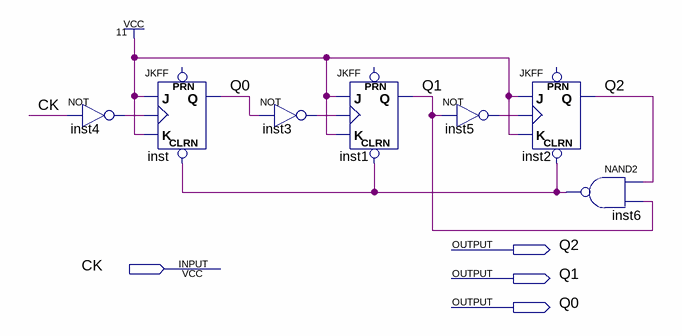
[diagram p0: schematic sheet]
// Quartus schematic 6_MOD_A_U.bdf as structural Verilog: 7 symbols, 4 pins
module \6_MOD_A_U  (
  input  CK,
  output Q2,
  output Q1,
  output Q0
);

  wire inst3_out, inst4_out, inst5_out, inst6_out;

  not inst4 (inst4_out, CK);
  JKFF inst (.CLRN(inst6_out), .K(1'b1), .J(1'b1), .CLK(inst4_out), .Q(Q0));  // open: PRN
  not inst3 (inst3_out, Q0);
  JKFF inst1 (.CLRN(inst6_out), .K(1'b1), .J(1'b1), .CLK(inst3_out), .Q(Q1));  // open: PRN
  not inst5 (inst5_out, Q1);
  JKFF inst2 (.CLRN(inst6_out), .K(1'b1), .J(1'b1), .CLK(inst5_out), .Q(Q2));  // open: PRN
  nand inst6 (inst6_out, Q2, Q1);
endmodule
